# Altium schematic sheet power-control.SchDoc
size A4; SheetNumber: 6; SheetTotal: 6
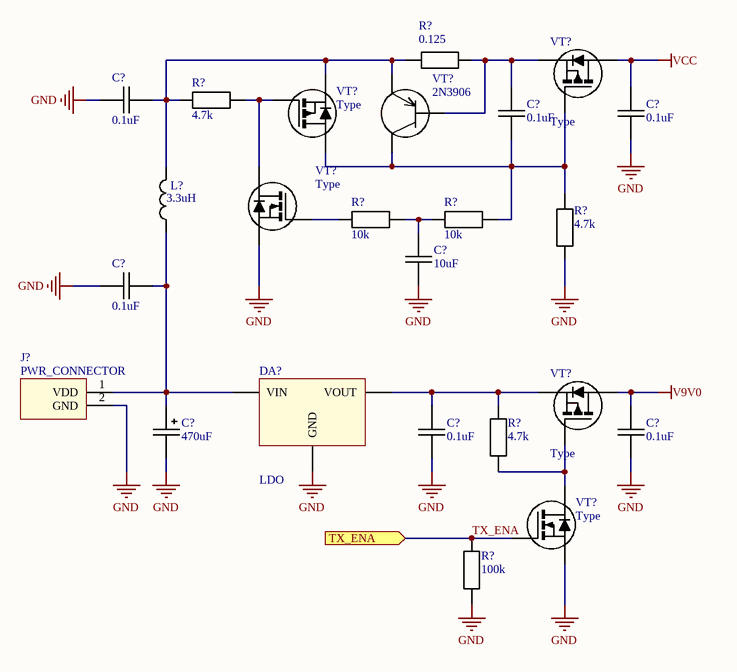
[diagram p0: power-control.SchDoc]

## Parts
(Parts that share a designator on the sheet are numbered #1, #2 ... from top to bottom, then left to right.)
C?#1  0.1uF  [CAPC2013X100N]
C?#2  0.1uF  [CAPC2013X100N]
C?#3  0.1uF  [CAPC2013X100N]
C?#4  10uF  [CAPC2013X100N]
C?#5  0.1uF  [CAPC2013X100N]
C?#6  470uF  [CAPMP7343X430N]
C?#7  0.1uF  [CAPC2013X100N]
C?#8  0.1uF  [CAPC2013X100N]
DA?  LDO
J?  PWR_CONNECTOR
L?  3.3uH
R?#1  0.125  [RESC2013X64N]
R?#2  4.7k  [RESC2013X64N]
R?#3  4.7k  [RESC2013X64N]
R?#4  10k  [RESC2013X64N]
R?#5  10k  [RESC2013X64N]
R?#6  4.7k  [RESC2013X64N]
R?#7  100k  [RESC2013X64N]
VT?#1  Type  [SOT23]
VT?#2  Type  [SOT23]
VT?#3  2N3906
VT?#4  Type  [SOT23]
VT?#5  Type  [SOT23]
VT?#6  Type  [SOT23]

## Ports
TX_ENA (in)

## Nets
GND: C?#1.2 C?#3.1 C?#4.1 C?#5.2 C?#6.2 C?#7.1 C?#8.1 DA?.3(GND) J?.2(GND) R?#3.2 R?#7.1 VT?#4.2(S) VT?#6.2(S)
V9V0: C?#8.2 VT?#5.3(D)
VCC: C?#3.2 VT?#1.3(D)
TX_ENA: R?#7.2 VT?#6.1(G) ; port TX_ENA
NetC?#1_1: C?#1.1 L?.2 R?#1.1 R?#2.2 VT?#2.2(S) VT?#3.2(E)
NetC?#2_1: C?#2.1 R?#3.1 R?#5.1 VT?#1.1(G) VT?#2.3(D) VT?#3.3(C)
NetC?#2_2: C?#2.2 R?#1.2 VT?#1.2(S) VT?#3.1(B)
NetC?#4_2: C?#4.2 R?#4.1 R?#5.2
NetC?#5_1: C?#5.1 C?#6.1 DA?.1(VIN) J?.1(VDD) L?.1
NetC?#7_2: C?#7.2 DA?.2(VOUT) R?#6.2 VT?#5.2(S)
NetR?#2_1: R?#2.1 VT?#2.1(G) VT?#4.3(D)
NetR?#4_2: R?#4.2 VT?#4.1(G)
NetR?#6_1: R?#6.1 VT?#5.1(G) VT?#6.3(D)

## Library data of the parts
C?#1-C?#5 C?#7 C?#8 = Cap0805: Capacitor 2x1.25 mm
C?#6 = CapPolarized: TECAP 100/20V E 10
L? = Inductor
R?#1-R?#7 = Res0805
VT?#1 VT?#2 VT?#5 = P-MOSFET
VT?#3 = p-n-p Bipolar Transistor
VT?#4 VT?#6 = N-MOSFET